# Altium schematic sheet [3]_Sensors.SchDoc
size A4; SheetNumber: 3; SheetTotal: 3
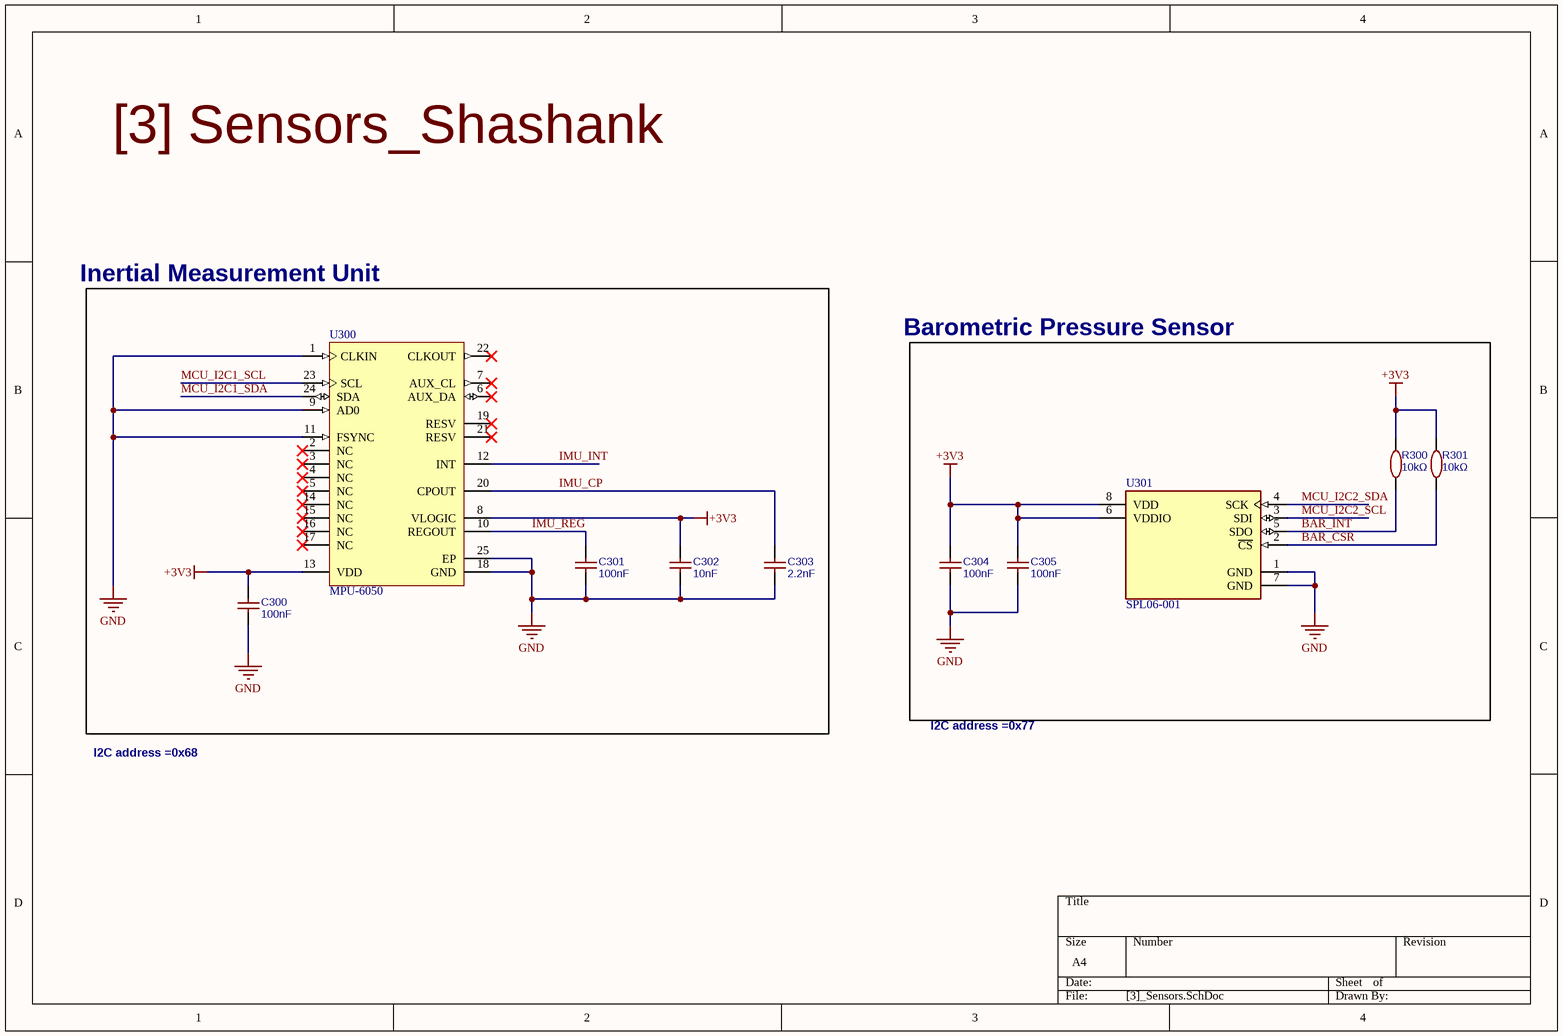
[diagram p0: [3]_Sensors.SchDoc]

## Parts
C300  100nF  [C0402]
C301  100nF  [C0402]
C302  10nF  [C0402]
C303  2.2nF  [C0402]
C304  100nF  [C0402]
C305  100nF  [C0402]
R300  10kΩ  [R0402]
R301  10kΩ  [R0402]
U300  MPU-6050  [IS-QFN-24_V]
U301  SPL06-001  [FP-BMP280-MFG]

## Nets
+3V3: C300.2 C302.2 C304.2 C305.2 R300.2 R301.2 U300.8(VLOGIC) U300.13(VDD) U301.6(VDDIO) U301.8(VDD)
GND: C300.1 C301.1 C302.1 C303.1 C304.1 C305.1 U300.1(CLKIN) U300.9(AD0) U300.11(FSYNC) U300.18(GND) U300.25(EP) U301.1(GND) U301.7(GND)
BAR_CSR: R301.1 U301.2(~{CS})
BAR_INT: R300.1 U301.5(SDO)
IMU_CP: C303.2 U300.20(CPOUT)
IMU_INT: U300.12(INT)
IMU_REG: C301.2 U300.10(REGOUT)
MCU_I2C1_SCL: U300.23(SCL)
MCU_I2C1_SDA: U300.24(SDA)
MCU_I2C2_SCL: U301.3(SDI)
MCU_I2C2_SDA: U301.4(SCK)

Not connected (* = marked no-connect by the designer): U300 2(NC)* 3(NC)* 4(NC)* 5(NC)* 6(AUX_DA)* 7(AUX_CL)* 14(NC)* 15(NC)* 16(NC)* 17(NC)* 19(RESV)* 21(RESV)* 22(CLKOUT)*

## Notes on the sheet
- [3] Sensors_Shashank
- Inertial Measurement Unit
- Barometric Pressure Sensor
- I2C address =0x68
- I2C address =0x77

## Library data of the parts
C300-C305 = 470pF: Manufacturer: FH(风华); Manufacturer Part: 0402B471K500NT; nameAlias: Value; Supplier: LCSC; Supplier Part: C1537; JLCPCB Part Class: Basic Part; link: https://lcsc.com/eda_search?q=C1537&%26type=1&ref=editor; spicePre: C; spiceSymbolName: 0402B471K500NT
R300 R301 = 1kΩ: Manufacturer: UNI-ROYAL(厚声); Manufacturer Part: 0402WGF1001TCE; nameAlias: Value; Supplier: LCSC; Supplier Part: C11702; JLCPCB Part Class: Basic Part; link: https://lcsc.com/eda_search?q=C11702&%26type=1&ref=editor; spicePre: R; spiceSymbolName: 0402WGF1001TCE
U300 = CMP-1753-00002-2: 3-Axis Gyroscope, Accelerometer and a Digital Motion Processor(TM) (DMP), 2.375 to 3.46 V, -40 to 85 degC, 24-Pin QFN, RoHS, Tape and Reel; Manufacturer: InvenSense; Featured Product: MPU-60506-Axis,IntegratedI²CSolution; Other Names: 1428-1007-2 / MPU6050; Sensor Type: MotionTracking; Online Catalog: MPU-6000™Series; Unit PriceUSD: Digital; Datasheet Version: Rev. 3.3, 05/2012; Category: Sensors,Transducers; Datasheet URL: http://datasheet.octopart.com/MPU-6050-InvenSense-datasheet-14421344.pdf; Family: Multifunction; Standard Package: 5,000; Manufacturer URL: http://www.invensense.com/; Output Type: Digital; Dynamic Catalog: MPU-6000™Series
U301 = CMP-2000-05076-3: SENSOR PRESSURE ABS; Operating Pressure: 15.95PSI; Pressure Type: Absolute; Output Type: SPI; Max Pressure: 290.08PSI; Port Style: No Port; Case/Package: SMD/SMT; Lead Free: Lead Free; Termination: SMD/SMT; Min Operating Temperature: -40°C; Number of Pins: 8; Max Operating Temperature: 85°C